# Altium schematic sheet IoTaWat_DIN.SchDoc: IoTaWatt_DIN
size 420 x 297 mm; Author: G.Kasprowicz; CompanyName: WUT ISE; DrawnBy: G.Kasprowicz; Organization: WUT ISE; Address1: PW ISE; Address2: Nowowiejska 15/19 00-665 Warsaw; Address3: gkasprow@gmail.com; Revision: 1.0; SheetNumber: 1; SheetTotal: 1; ModifiedBy: -; CheckedDate: -; Title2: v1.0; DivGrp: WUT ISE; Designer: G.Kasprowicz; ModifiedDate: -; ProjectName: Sensor Box
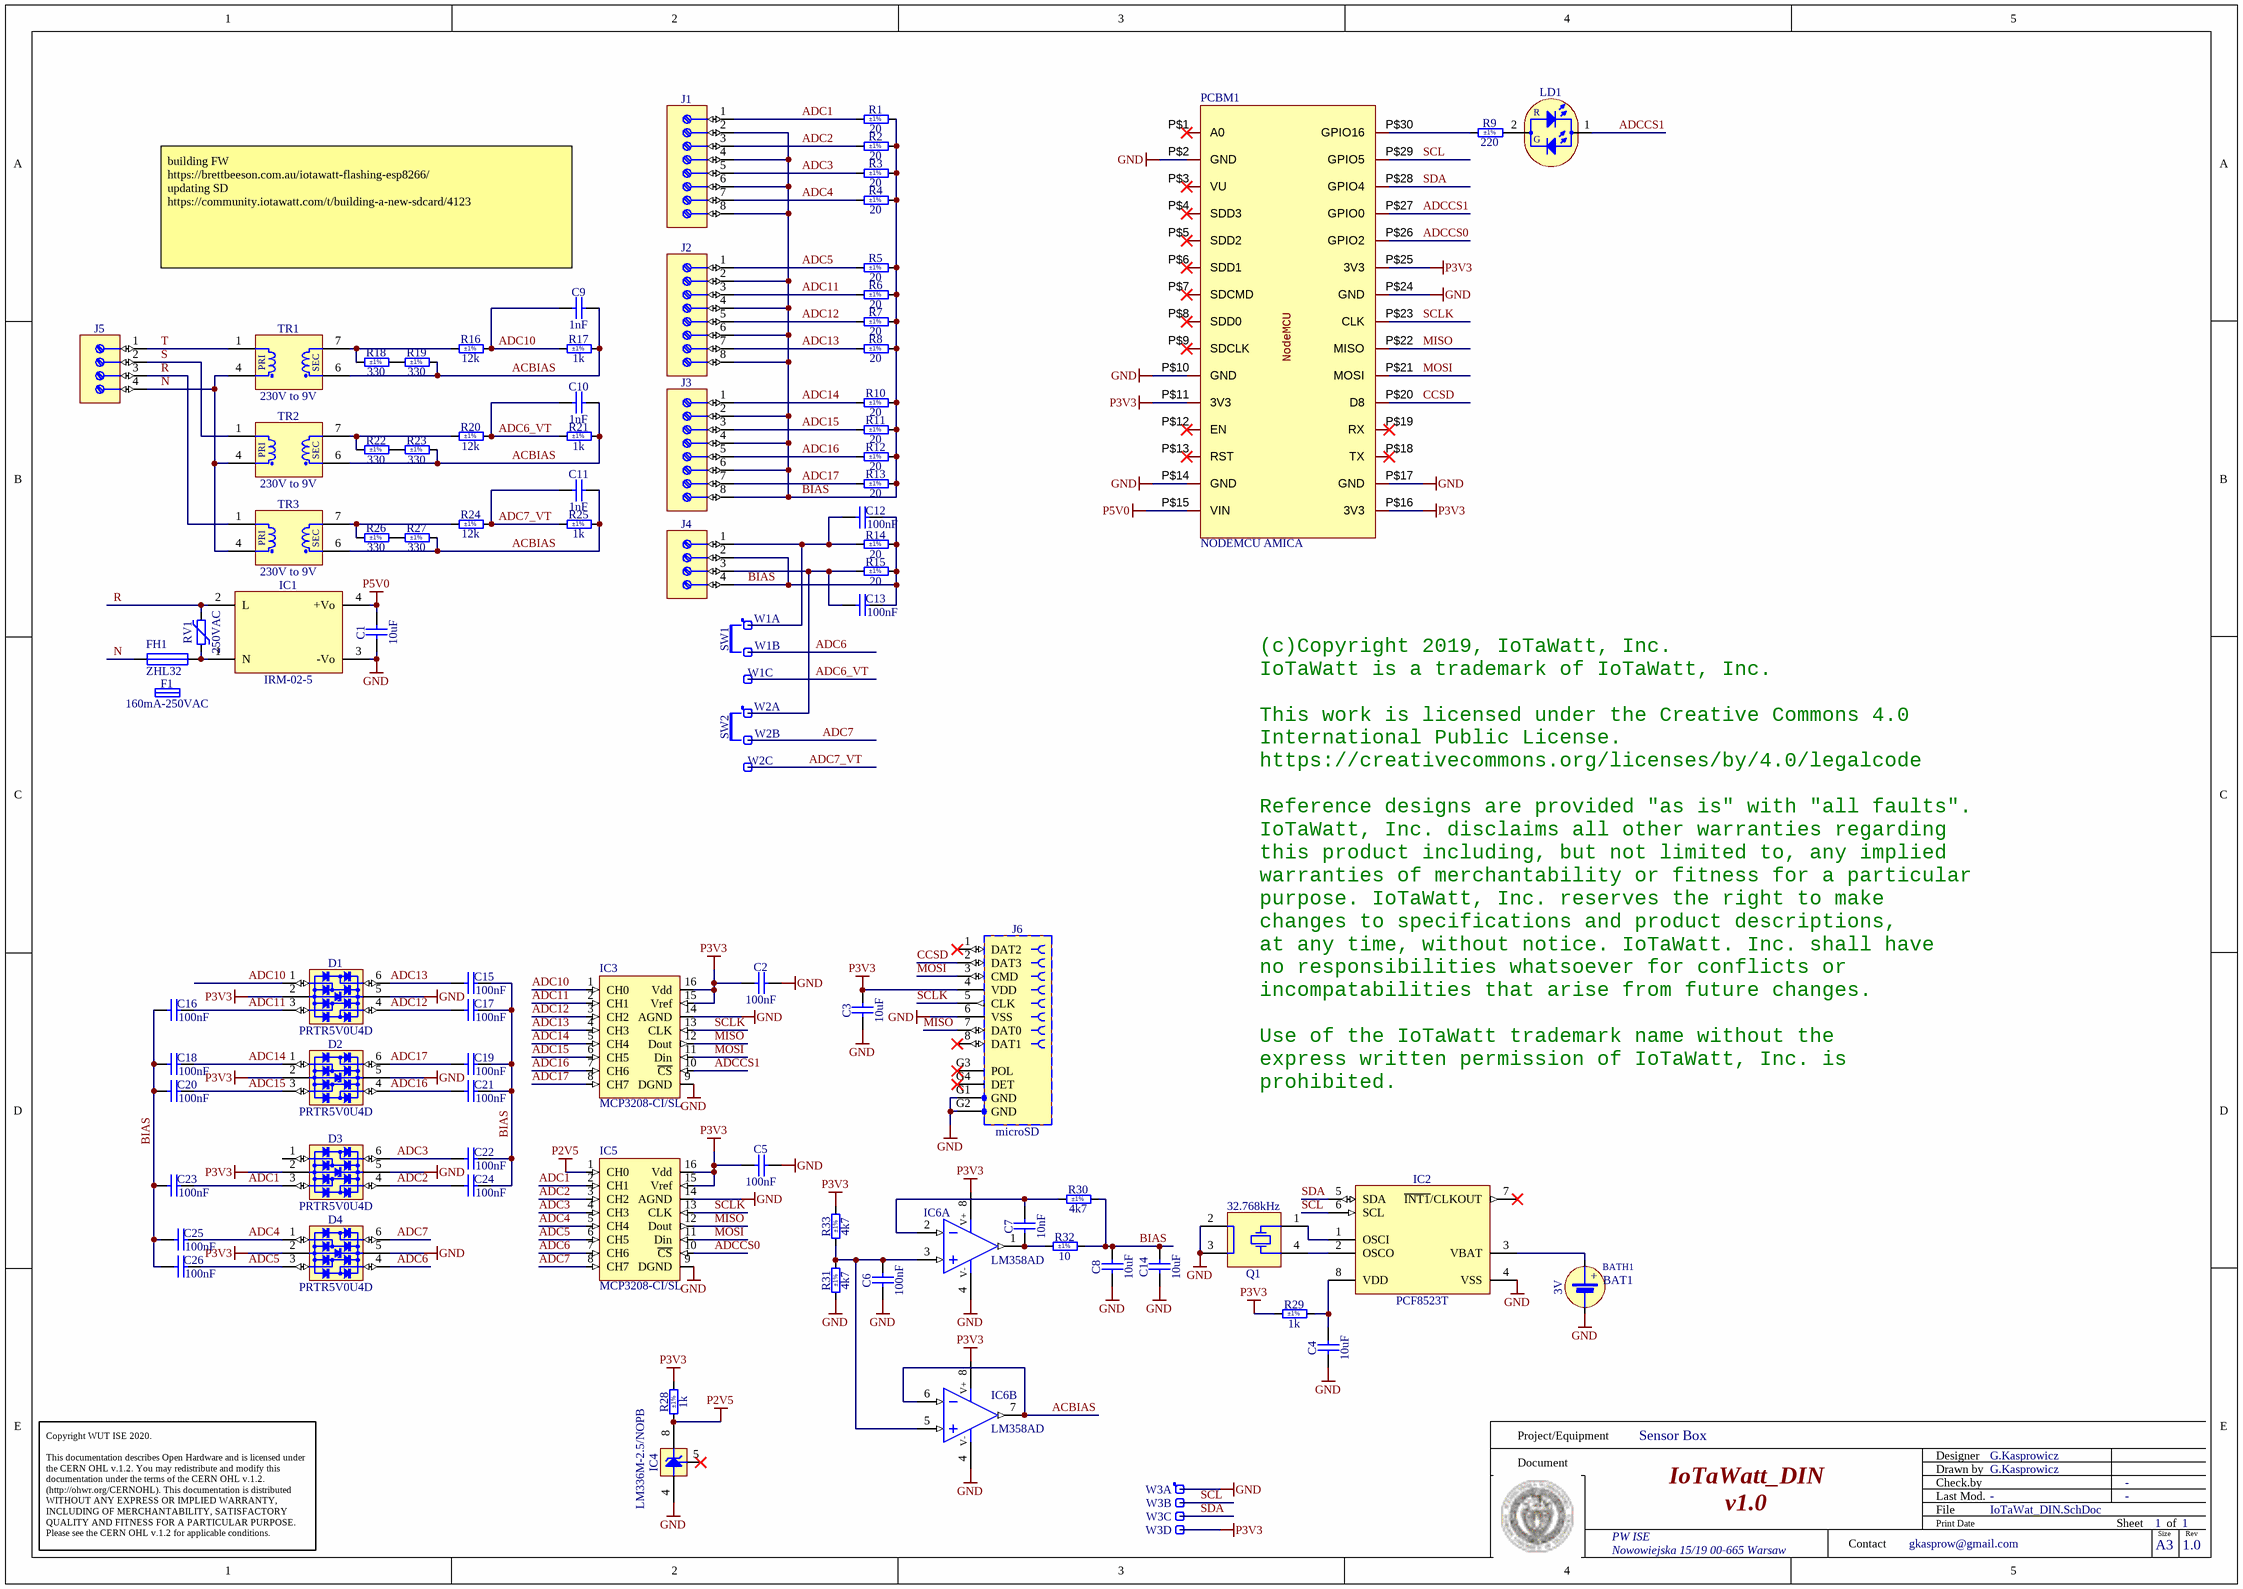
[diagram p0: IoTaWat_DIN.SchDoc]

## Parts
BAT1  3V  [BAT_VARTA_CR1220]
BATH1  (no value)  [BATH_KEYSTONE_3000]
C1  10uF  [CAPC2012X135N]
C2  100nF  [CAPC1608X87N]
C3  10uF  [CAPC2012X135N]
C4  10uF  [CAPC2012X135N]
C5  100nF  [CAPC1608X87N]
C6  100nF  [CAPC1608X87N]
C7  10nF  [CAPC1608X87N]
C8  10uF  [CAPC2012X135N]
C9  1nF  [CAPC1608X90N]
C10  1nF  [CAPC1608X90N]
C11  1nF  [CAPC1608X90N]
C12  100nF  [CAPC1608X87N]
C13  100nF  [CAPC1608X87N]
C14  10uF  [CAPC2012X135N]
C15  100nF  [CAPC1608X87N]
C16  100nF  [CAPC1608X87N]
C17  100nF  [CAPC1608X87N]
C18  100nF  [CAPC1608X87N]
C19  100nF  [CAPC1608X87N]
C20  100nF  [CAPC1608X87N]
C21  100nF  [CAPC1608X87N]
C22  100nF  [CAPC1608X87N]
C23  100nF  [CAPC1608X87N]
C24  100nF  [CAPC1608X87N]
C25  100nF  [CAPC1608X87N]
C26  100nF  [CAPC1608X87N]
D1  PRTR5V0U4D  [SOT95P275X110-6N]
D2  PRTR5V0U4D  [SOT95P275X110-6N]
D3  PRTR5V0U4D  [SOT95P275X110-6N]
D4  PRTR5V0U4D  [SOT95P275X110-6N]
F1  160mA-250VAC  [FUSE_5X20_GLASS_h]
FH1  ZHL32  [fuse_ZHL32]
IC1  IRM-02-5  [PWS_MEANWELL_IRM-02]
IC2  PCF8523T  [SOIC127P600X175-8N]
IC3  MCP3208-CI/SL  [SO-16]
IC4  LM336M-2.5/NOPB  [SOIC127P600X175-8N]
IC5  MCP3208-CI/SL  [SO-16]
IC6  LM358AD  [SOIC127P600X175-8N]  (parts A,B of 2)
J1  (no value)  [PHOENIX_1715789]
J2  (no value)  [PHOENIX_1715789]
J3  (no value)  [PHOENIX_1715789]
J4  (no value)  [PHOENIX_1715747]
J5  (no value)  [PHOENIX_1715747]
J6  microSD  [MOLEX_47309-2651]
LD1  Red/Green  [LED_KINGBRIGHT_L-937EGW]  (value not drawn)
PCBM1  NODEMCU AMICA  [NODEMCU]
Q1  32.768kHz  [XTAL_ABRACON_ABS25]
R1  20  Tolerance: ±1%  [RESC2012X60N]
R2  20  Tolerance: ±1%  [RESC2012X60N]
R3  20  Tolerance: ±1%  [RESC2012X60N]
R4  20  Tolerance: ±1%  [RESC2012X60N]
R5  20  Tolerance: ±1%  [RESC2012X60N]
R6  20  Tolerance: ±1%  [RESC2012X60N]
R7  20  Tolerance: ±1%  [RESC2012X60N]
R8  20  Tolerance: ±1%  [RESC2012X60N]
R9  220  Tolerance: ±1%  [RESC1608X55N]
R10  20  Tolerance: ±1%  [RESC2012X60N]
R11  20  Tolerance: ±1%  [RESC2012X60N]
R12  20  Tolerance: ±1%  [RESC2012X60N]
R13  20  Tolerance: ±1%  [RESC2012X60N]
R14  20  Tolerance: ±1%  [RESC2012X60N]
R15  20  Tolerance: ±1%  [RESC2012X60N]
R16  12k  Tolerance: ±1%  [RESC1608X55N]
R17  1k  Tolerance: ±1%  [RESC1608X55N]
R18  330  Tolerance: ±1%  [RESC3216X65N]
R19  330  Tolerance: ±1%  [RESC3216X65N]
R20  12k  Tolerance: ±1%  [RESC1608X55N]
R21  1k  Tolerance: ±1%  [RESC1608X55N]
R22  330  Tolerance: ±1%  [RESC3216X65N]
R23  330  Tolerance: ±1%  [RESC3216X65N]
R24  12k  Tolerance: ±1%  [RESC1608X55N]
R25  1k  Tolerance: ±1%  [RESC1608X55N]
R26  330  Tolerance: ±1%  [RESC3216X65N]
R27  330  Tolerance: ±1%  [RESC3216X65N]
R28  1k  Tolerance: ±1%  [RESC1608X55N]
R29  1k  Tolerance: ±1%  [RESC1608X55N]
R30  4k7  Tolerance: ±1%  [RESC1608X55N]
R31  4k7  Tolerance: ±1%  [RESC1608X55N]
R32  10  Tolerance: ±1%  [RESC1608X55N]
R33  4k7  Tolerance: ±1%  [RESC1608X55N]
RV1  250VAC  [VAR_EPCOS_B72214S0251K101]
SW1  Jumper Type1  [JUMPER_BLACK_INSULATED_2.54MM]  (value not drawn)
SW2  Jumper Type1  [JUMPER_BLACK_INSULATED_2.54MM]  (value not drawn)
TR1  230V to 9V  [XFMR_BLOCK_TEZ0.5/D]
TR2  230V to 9V  [XFMR_BLOCK_TEZ0.5/D]
TR3  230V to 9V  [XFMR_BLOCK_TEZ0.5/D]
W1  Test Point  [COMATEL_385.0358.1.03.400]  (value not drawn)  (parts A,B,C of 3)
W2  Test Point  [COMATEL_385.0358.1.03.400]  (value not drawn)  (parts A,B,C of 3)
W3  Test Point  [COMATEL_385.0358.1.04.400]  (value not drawn)  (parts A,B,C,D of 4)

## Nets
GND: BATH1.2(MINUS) C1.1 C2.2 C3.1 C4.1 C5.2 C6.1 C8.1 C14.1 D1.5(VBUS) D2.5(VBUS) D3.5(VBUS) D4.5(VBUS) IC1.3(-Vo) IC2.4(VSS) IC3.9(DGND) IC3.14(AGND) IC4.4(A) IC5.9(DGND) IC5.14(AGND) IC6.4(V-) J6.6(VSS) J6.G1(GND) J6.G2(GND) PCBM1.P$2(GND) PCBM1.P$10(GND) PCBM1.P$14(GND) PCBM1.P$17(GND) PCBM1.P$24(GND) Q1.2(GND) Q1.3(GND) R31.1 W3.1
P2V5: IC4.8(C) IC5.1(CH0) R28.1
P3V3: C2.1 C3.2 C5.1 D1.2(GND) D2.2(GND) D3.2(GND) D4.2(GND) IC3.15(Vref) IC3.16(Vdd) IC5.15(Vref) IC5.16(Vdd) IC6.8(V+) J6.4(VDD) PCBM1.P$11(3V3) PCBM1.P$16(3V3) PCBM1.P$25(3V3) R28.2 R29.1 R33.2 W3.4
P5V0: C1.2 IC1.4(+Vo) PCBM1.P$15(VIN)
ACBIAS: C9.2 C10.2 C11.2 IC6.6(IN-) IC6.7(OUT) R17.2 R19.2 R21.2 R23.2 R25.2 R27.2 TR1.6 TR2.6 TR3.6
ADC1: C23.2 D3.3(I/O2) IC5.2(CH1) J1.1 R1.1
ADC2: C24.1 D3.4(I/O3) IC5.3(CH2) J1.3 R2.1
ADC3: C22.1 D3.6(I/O4) IC5.4(CH3) J1.5 R3.1
ADC4: C25.2 D4.1(I/O1) IC5.5(CH4) J1.7 R4.1
ADC5: C26.2 D4.3(I/O2) IC5.6(CH5) J2.1 R5.1
ADC6: D4.4(I/O3) IC5.7(CH6) W1.2
ADC6_VT: C10.1 R20.2 R21.1 W1.3
ADC7: D4.6(I/O4) IC5.8(CH7) W2.2
ADC7_VT: C11.1 R24.2 R25.1 W2.3
ADC10: C9.1 D1.1(I/O1) IC3.1(CH0) R16.2 R17.1
ADC11: C16.2 D1.3(I/O2) IC3.2(CH1) J2.3 R6.1
ADC12: C17.1 D1.4(I/O3) IC3.3(CH2) J2.5 R7.1
ADC13: C15.1 D1.6(I/O4) IC3.4(CH3) J2.7 R8.1
ADC14: C18.2 D2.1(I/O1) IC3.5(CH4) J3.1 R10.1
ADC15: C20.2 D2.3(I/O2) IC3.6(CH5) J3.3 R11.1
ADC16: C21.1 D2.4(I/O3) IC3.7(CH6) J3.5 R12.1
ADC17: C19.1 D2.6(I/O4) IC3.8(CH7) J3.7 R13.1
ADCCS0: IC5.10(~{CS}) PCBM1.P$26(GPIO2)
ADCCS1: IC3.10(~{CS}) LD1.1(CR) PCBM1.P$27(GPIO0)
BIAS: C8.2 C12.2 C13.2 C14.2 C15.2 C16.1 C17.2 C18.1 C19.2 C20.1 C21.2 C22.2 C23.1 C24.2 C25.1 C26.1 J1.2 J1.4 J1.6 J1.8 J2.2 J2.4 J2.6 J2.8 J3.2 J3.4 J3.6 J3.8 J4.2 J4.4 R1.2 R2.2 R3.2 R4.2 R5.2 R6.2 R7.2 R8.2 R10.2 R11.2 R12.2 R13.2 R14.2 R15.2 R30.2 R32.2
CCSD: J6.2(DAT3) PCBM1.P$20(D8)
MISO: IC3.12(Dout) IC5.12(Dout) J6.7(DAT0) PCBM1.P$22(MISO)
MOSI: IC3.11(Din) IC5.11(Din) J6.3(CMD) PCBM1.P$21(MOSI)
N: FH1.1 J5.4 TR1.4 TR2.4 TR3.4
R: IC1.2(L) J5.3 RV1.2 TR3.1
S: J5.2 TR2.1
SCL: IC2.6(SCL) PCBM1.P$29(GPIO5) W3.2
SCLK: IC3.13(CLK) IC5.13(CLK) J6.5(CLK) PCBM1.P$23(CLK)
SDA: IC2.5(SDA) PCBM1.P$28(GPIO4) W3.3
T: J5.1 TR1.1
NetBATH1_1: BATH1.1(PLUS) IC2.3(VBAT)
NetC4_2: C4.2 IC2.8(VDD) R29.2
NetC6_2: C6.2 IC6.3(IN+) IC6.5(IN+) R31.2 R33.1
NetC7_1: C7.1 IC6.1(OUT) R32.1
NetC7_2: C7.2 IC6.2(IN-) R30.1
NetC12_1: C12.1 J4.1 R14.1 W1.1
NetC13_1: C13.1 J4.3 R15.1 W2.1
NetFH1_2: FH1.2 IC1.1(N) RV1.1
NetIC2_1: IC2.1(OSCI) Q1.1(X)
NetIC2_2: IC2.2(OSCO) Q1.4(X)
NetLD1_2: LD1.2(AR) R9.2
NetPCBM1_P$30: PCBM1.P$30(GPIO16) R9.1
NetR16_1: R16.1 R18.1 TR1.7
NetR18_2: R18.2 R19.1
NetR20_1: R20.1 R22.1 TR2.7
NetR22_2: R22.2 R23.1
NetR24_1: R24.1 R26.1 TR3.7
NetR26_2: R26.2 R27.1

Not connected (* = marked no-connect by the designer): D3 1(I/O1); IC2 7(~{INT1}/CLKOUT)*; IC4 5(Adj)*; J6 1(DAT2)* 8(DAT1)* G3(POL)* G4(DET)*; PCBM1 P$1(A0)* P$3(VU)* P$4(SDD3)* P$5(SDD2)* P$6(SDD1)* P$7(SDCMD)* P$8(SDD0)* P$9(SDCLK)* P$12(EN)* P$13(RST)* P$18(TX)* P$19(RX)*; SW1 1; SW2 1

## Notes on the sheet
- (near C9) building FW
  https://brettbeeson.com.au/iotawatt-flashing-esp8266/
  updating SD
  https://community.iotawatt.com/t/building-a-new-sdcard/4123
- (c)Copyright 2019, IoTaWatt, Inc.
  IoTaWatt is a trademark of IoTaWatt, Inc.
  This work is licensed under the Creative Commons 4.0
  International Public License.
  https://creativecommons.org/licenses/by/4.0/legalcode
  Reference designs are provided "as is" with "all faults".
  IoTaWatt, Inc. disclaims all other warranties regarding
  this product including, but not limited to, any implied
  warranties of merchantability or fitness for a particular
  purpose. IoTaWatt, Inc. reserves the right to make
  changes to specifications and product descriptions,
  at any time, without notice. IoTaWatt. Inc. shall have
  no responsibilities whatsoever for conflicts or
  incompatabilities that arise from future changes.
  Use of the IoTaWatt trademark name without the
  express written permission of IoTaWatt, Inc. is
  prohibited.
- Project/Equipment
- Document
- Designer
- Drawn by
- Check.by
- Copyright WUT ISE 2020.
  This documentation describes Open Hardware and is licensed under the CERN OHL v.1.2. You may redistribute and modify this documentation under the terms of the CERN OHL v.1.2. (http://ohwr.org/CERNOHL). This documentation is distributed WITHOUT ANY EXPRESS OR IMPLIED WARRANTY, INCLUDING OF MERCHANTABILITY, SATISFACTORY QUALITY AND FITNESS FOR A PARTICULAR PURPOSE. Please see the CERN OHL v.1.2 for applicable conditions.
- Contact
- File
- Last Mod.
- Print Date
- Sheet
- Size
- A3
- of
- Rev
- (in symbol BAT_VARTA_CR1220) +
- (in symbol BATH_KEYSTONE_3000) +
- (in symbol LED_KINGBRIGHT_L-937EGW) R; G
- (in symbol Tr_TEZ0.5/D230/9V) PRI; SEC

## Library data of the parts
BAT1 = BAT_VARTA_CR1220: Battery for use only with Socket Holder; Part Description: CR1210, 12.5mm Diameter x 2mm  Height Lithium Coin Cells; Manufacturer: VARTA; Manufacturer Part Number: 6220; PressFit: No; Power: 35mAh; Part Number: BAT_VARTA_CR1220; Component Kind: Accessories; Component Type: Standard; Pin Count: 0; PackageDescription: CR1210, 12.5mm Diameter x 2mm  Height Lithium Coin Cells; Family: Battery; Mounted: Yes; Socket: Yes; SMD: No; Sense: No; Value: 3V; ComponentHeight: 2mm; HelpURL: \\cern.ch\dfs\Applications\Altium\Datasheets\BAT_VARTA_CR1220.pdf; Author: CERN DEM JLC; CreateDate: 17.04.2012; LatestRevisionDate: 17.04.2012
BATH1 = BATH_KEYSTONE_3000: Battery Holder whit 2 Pin; Part Description: SMD Battery Holder for CR1216, BR1220, CL1225, SR1120, D381, 391, 191 Coin Cells; Manufacturer Part Number: 3000; PressFit: No; Part Number: BATH_KEYSTONE_3000; Component Kind: Standard; Component Type: Standard; Pin Count: 3; PackageDescription: SMD Battery Holder for CR1216, BR1220, CL1225, SR1120, D381, 391, 191 Coin Cells; Family: Battery; Mounted: Yes; Socket: No; SMD: Yes; Sense: No; Manufacturer: KEYSTONE; ComponentHeight: 3.17mm; HelpURL: \\cern.ch\dfs\Applications\Altium\Datasheets\BATH_KEYSTONE_3000.pdf; Author: CERN DEM JLC; CreateDate: 17.04.2012; LatestRevisionDate: 07.06.2017
C1 C3 C4 C8 C14 = CC0805_10UF_10V_10%_X7R: Non-polarised capacitor; Part Description: SMD Multilayer Chip Ceramic Capacitor; Manufacturer: GENERIC; Manufacturer1 Part Number: GRM21BR71A106KE51L; Voltage: 10V; TC: X7R; Tolerance: ±10%; Part Number: CC0805_10UF_10V_10%_X7R; Component Kind: Standard; Component Type: Standard; Pin Count: 2; Value: 10uF; Status: Preferred; Manufacturer Part Number: CC0805_10UF_10V_10%_X7R; Case: 0805; Mounted: Yes; Socket: No; SMD: Yes; Sense: No; Manufacturer1 Example: MURATA; Manufacturer1 ComponentHeight: 1.35mm; HelpURL: \\cern.ch\dfs\Applications\Altium\Datasheets\CC0805_X7R_MURATA.pdf; Author: CERN DEM JLC; CreateDate: 30.04.2012; LatestRevisionDate: 30.04.2012
C2 C5 C6 C12 C13 C15-C26 = CC0603_100NF_50V_10%_X5R: Non-polarised capacitor; Part Description: SMD Multilayer Chip Ceramic Capacitor; Manufacturer: GENERIC; Manufacturer1 Part Number: C1608X5R1H104K080; Voltage: 50V; TC: X5R; Tolerance: ±10%; Part Number: CC0603_100NF_50V_10%_X5R; Component Kind: Standard; Component Type: Standard; Pin Count: 2; Value: 100nF; Status: None; Manufacturer Part Number: CC0603_100NF_50V_10%_X5R; Case: 0603; Mounted: Yes; Socket: No; SMD: Yes; Sense: No; Manufacturer1 Example: TDK; Manufacturer1 ComponentHeight: 0.9mm; HelpURL: \\cern.ch\dfs\Applications\Altium\Datasheets\CC0603_X5R_TDK_C.pdf; Author: CERN DEM MR; CreateDate: 08.01.2016; LatestRevisionDate: 08.01.2016
C7 = CC0603_10NF_50V_5%_C0G: Non-polarised capacitor; Part Description: SMD Multilayer Chip Ceramic Capacitor; Manufacturer: GENERIC; Manufacturer1 Part Number: C1608C0G1H103J080; Voltage: 50V; TC: C0G/NP0; Tolerance: ±5%; Part Number: CC0603_10NF_50V_5%_C0G; Component Kind: Standard; Component Type: Standard; Pin Count: 2; Value: 10nF; Status: Preferred; Manufacturer Part Number: CC0603_10NF_50V_5%_C0G; Case: 0603; Mounted: Yes; Socket: No; SMD: Yes; Sense: No; Manufacturer1 Example: TDK; Manufacturer1 ComponentHeight: 0.9mm; HelpURL: \\cern.ch\dfs\Applications\Altium\Datasheets\CC0603_C0G_TDK_C.pdf; Author: CERN DEM JLC; CreateDate: 10.12.2014; LatestRevisionDate: 10.12.2014
C9-C11 = CC0603_1NF_50V_1%_NP0: Non-polarised capacitor; Part Description: SMD Multilayer Chip Ceramic Capacitor; Manufacturer: GENERIC; Manufacturer1 Part Number: 06035A102FAT2A; Voltage: 50V; TC: C0G/NP0; Tolerance: ±1%; Part Number: CC0603_1NF_50V_1%_NP0; Component Kind: Standard; Component Type: Standard; Pin Count: 2; Value: 1nF; Status: None; Manufacturer Part Number: CC0603_1NF_50V_1%_NP0; Case: 0603; Mounted: Yes; Socket: No; SMD: Yes; Sense: No; Manufacturer1 Example: AVX; Manufacturer1 ComponentHeight: 0.9mm; HelpURL: \\cern.ch\dfs\Applications\Altium\Datasheets\CC0603_C0G_AVX.pdf; Author: CERN DEM JLC; CreateDate: 15.06.2017; LatestRevisionDate: 15.06.2017
D1-D4 = PRTR5V0U4D: Ultra Low Capacitance Quadruple Rail-to-Rail ESD Protection; Part Description: Ultra Low Capacitance Quadruple Rail-to-Rail ESD (±8kV) Protection; Manufacturer: NEXPERIA; PressFit: No; Bonding: No; Part Number: PRTR5V0U4D; Component Kind: Standard; Component Type: Standard; Device: PRTR5V0U4D; PackageDescription: SOT, 0.95mm Pitch; 6 Pin, 1.50mm W X 2.90mm L X 1.10mm H body, IPC Medium Density; Manufacturer Part Number: PRTR5V0U4D; Pin Count: 6; Case: SOT457-6; Mounted: Yes; Socket: No; SMD: Yes; Sense: No; ComponentHeight: 1.1mm; HelpURL: \\cern.ch\dfs\Applications\Altium\Datasheets\PRTR5V0U4D.pdf; Author: CERN DEM BC; CreateDate: 06.01.2021; LatestRevisionDate: 06.01.2021
F1 = FUSE_SCHURTER_0034.1508_h: Fuse; Part Description: Cylindrical 5x20 mm, Quick-Acting F Miniature Fuse, FSF Series; PressFit: No; Part Number: FUSE_SCHURTER_0034.1508_h; Component Kind: Accessories; Component Type: Standard; Pin Count: 0; PackageDescription: 5x20mm Cylindrical Fuse, SCHURTER FSF5X20 Series; Family: Fuse; Mounted: Yes; Socket: Yes; SMD: No; Sense: No; Value: 160mA-250VAC; Manufacturer: SCHURTER; Manufacturer Part Number: 0034.1508; ComponentHeight: 5.2mm; HelpURL: \\cern.ch\dfs\Applications\Altium\Datasheets\FUSE_SCHURTER_FSF5X20.pdf; Author: CERN DEM JLC; CreateDate: 08.11.2012; LatestRevisionDate: 08.11.2012
FH1 = FUSE
IC1 = AC_DC_IRM-02-5: Power Supply; Part Description: 85-305VAC to 5VDC (400mA) 2W Power Supply; Manufacturer: MEAN WELL; PressFit: No; Bonding: No; Part Number: IRM-02-5; Component Kind: Standard; Component Type: Standard; Device: IRM-02-5; PackageDescription: IRM-02 Series, Body 33.7x22.2mm, Power Supply; Status: None; Manufacturer Part Number: IRM-02-5; Pin Count: 4; Mounted: Yes; Socket: No; SMD: No; Sense: No; ComponentHeight: 15mm; HelpURL: \\cern.ch\dfs\Applications\Altium\Datasheets\IRM-02-24.pdf; Author: GK; CreateDate: 14.02.2018; LatestRevisionDate: 14.02.2018
IC2 = PCF8523T: Real-Time Clock (RTC) and calendar; Manufacturer: NXP SEMICONDUCTORS; PressFit: No; Bonding: No; Part Number: PCF8523T; Component Kind: Standard; Component Type: Standard; Device: PCF8523T; PackageDescription: SOIC 8, Pitch 1.27mm, Body 4x5mm, IPC Medium Density; Part Description: Real-Time Clock (RTC) and calendar; Manufacturer Part Number: PCF8523T; Pin Count: 8; Case: SOIC8; Mounted: Yes; Socket: No; SMD: Yes; Sense: No; ComponentHeight: 1.75mm; Author: CERN DEM HF; HelpURL: \\cern.ch\dfs\Applications\Altium\Datasheets\PCF8523.pdf; CreateDate: 07.02.2023; LatestRevisionDate: 07.02.2023
IC3 IC5 = ADC_MCP3208: 8-Channel 12-Bit A/D with SPI
IC4 = LM336M-2.5/NOPB: Reference Diode; Part Description: 2.5V Voltage Reference Diode; Manufacturer: TEXAS INSTRUMENTS; PressFit: No; Bonding: No; Part Number: LM336M-2.5/NOPB; Component Kind: Standard; Component Type: Standard; Device: LM336M-2.5/NOPB; PackageDescription: SOIC 8, Pitch 1.27mm, Body 4x5mm, IPC Medium Density; Manufacturer Part Number: LM336M-2.5; Pin Count: 3; Case: SOIC8; Mounted: Yes; Socket: No; SMD: Yes; Sense: No; ComponentHeight: 1.75mm; HelpURL: \\cern.ch\dfs\Applications\Altium\Datasheets\LM336M-2.5-NOPB.pdf; Author: CERN DEM JLC; CreateDate: 12.04.2010; LatestRevisionDate: 01.06.2022
IC6 = LM358AD: Dual Operational Amplifier; Part Description: Dual Operational Amplifier, Vos=3mV, Iq/CH=350uA, 0°C to 70°C; Manufacturer: TEXAS INSTRUMENTS; PressFit: No; Bonding: No; Part Number: LM358AD; Component Kind: Standard; Component Type: Standard; Device: LM358AD; PackageDescription: SOIC 8, Pitch 1.27mm - Body 4x5mm, IPC Medium Density; Manufacturer Part Number: LM358AD; Pin Count: 8; Case: SOIC8; Mounted: Yes; Socket: No; SMD: Yes; Sense: No; ComponentHeight: 1.75mm; Author: CERN DEM JLC; HelpURL: \\cern.ch\dfs\Applications\Altium\Datasheets\LM358A.pdf; CreateDate: 02.12.2008; LatestRevisionDate: 06.09.2021
J1-J3 = PHOENIX_1715789: Terminal Block, 8 Positions, Screw Connection; Part Description: 17.5A, 400V, Terminal Block, Pitch 5.08mm, 8 Positions, Screw Connection; Manufacturer: PHOENIX CONTACT; Manufacturer Part Number: 1715789 (MKDS 1,5/8-5,08); PressFit: No; Part Number: PHOENIX_1715789; Component Kind: Standard; Component Type: Standard; Pin Count: 8; Mounted: Yes; Socket: No; SMD: No; Sense: No; Status: None; ComponentHeight: 13.8mm; HelpURL: \\cern.ch\dfs\Applications\Altium\Datasheets\PHOENIX_1715789.pdf; Author: CERN DEM JMW; CreateDate: 25.02.2013; LatestRevisionDate: 25.02.2013
J4 J5 = PHOENIX_1715747: Terminal Block, 4 Positions, Screw Connection; Part Description: 17.5A, 400V, Terminal Block, Pitch 5.08mm, 4 Positions, Screw Connection; Manufacturer: PHOENIX CONTACT; Manufacturer Part Number: 1715747 (MKDS 1,5/4-5,08); PressFit: No; Part Number: PHOENIX_1715747; Component Kind: Standard; Component Type: Standard; Pin Count: 4; Mounted: Yes; Socket: No; SMD: No; Sense: No; Status: None; ComponentHeight: 13.8mm; HelpURL: \\cern.ch\dfs\Applications\Altium\Datasheets\PHOENIX_1715747.pdf; Author: CERN DEM JMW; CreateDate: 25.02.2013; LatestRevisionDate: 25.02.2013
J6 = MOLEX_47309-2651: MicroSD Card Header with Detect Switch; Part Description: 1.10mm Pitch microSD Card Header with Detect Switch; Manufacturer: MOLEX; PressFit: No; Part Number: MOLEX_47309-2651; Component Kind: Standard; Component Type: Standard; Pin Count: 12; Family: microSD; Mounted: Yes; Socket: No; SMD: Yes; Sense: No; Status: None; Manufacturer Part Number: 47309-2651; ComponentHeight: 2.65mm; HelpURL: \\cern.ch\dfs\Applications\Altium\Datasheets\MOLEX_47309-2651.pdf; Author: CERN DEM JMW; CreateDate: 29.06.2017; LatestRevisionDate: 29.06.2017
LD1 = LED_KINGBRIGHT_L-937EGW: Red/ Green Bi color LED Pin 1 = Cathode Red Anode Green; Part Description: 3mm Diameter, Bi-Color Red/Green LED Lamp; PressFit: No; Bonding: No; Part Number: LED_KINGBRIGHT_L-937EGW; Component Kind: Standard; Component Type: Standard; Color: Red/Green; PackageDescription: Bi-Color (Red/ Green), 3mm Diameter LED, Leads Spacing 2.54mm; Manufacturer: KINGBRIGHT; Manufacturer Part Number: L-937EGW; Pin Count: 2; Mounted: Yes; Socket: No; SMD: No; Sense: No; ComponentHeight: 5.9mm; HelpURL: \\cern.ch\dfs\Applications\Altium\Datasheets\LED_KINGBRIGHT_L-937EGW.pdf; Author: CERN DEM JLC; CreateDate: 25.09.2017; LatestRevisionDate: 25.09.2017
PCBM1 = MOD_NODEMCU: NodeMCU 1.0 ESP8266; GateName_1: G$1; SymbolName_1: NODEMCU; LibraryName: IotaWatt_parts; DeviceSetName: NODEMCU; NodeMCU: NodeMCU
Q1 = XTAL_32.768KHZ_ABRACON_ABS25-32.768KHZ-T: Crystal 4 pins 1=XTAL Control 2 And 3=NC 4=XTAL; Part Description: Tolerance: ±20ppm, -40°C to +85°C, 12.5pF, SMD Crystal, ABS25 Series; PressFit: No; Bonding: No; Part Number: XTAL_32.768KHZ_ABRACON_ABS25-32.768KHZ-T; Component Kind: Standard; Component Type: Standard; PackageDescription: SMD Crystal, 4 Pins, 8.00mm L X 3.80mm W X 2.70mm H, ABS25 Serie; Value: 32.768kHz; Manufacturer: ABRACON; Manufacturer Part Number: ABS25-32.768KHZ-T; Pin Count: 4; Mounted: Yes; Socket: No; SMD: Yes; Sense: No; ComponentHeight: 2.7mm; HelpURL: \\cern.ch\dfs\Applications\Altium\Datasheets\XTAL_ABRACON_ABS25.pdf; Author: CERN DEM JMW; CreateDate: 15.07.2015; LatestRevisionDate: 15.07.2015
R1-R8 R10-R15 = R0805_20R_1%_0.125W_100PPM: Resistor - 1%; Part Description: General Purpose Thick Film Chip Resistor; Manufacturer: GENERIC; Manufacturer1 Part Number: NRC10F20R0TRF; Power: 0.125W; TC: ±100ppm/°C; PressFit: No; Part Number: R0805_20R_1%_0.125W_100PPM; Component Kind: Standard; Component Type: Standard; Pin Count: 2; Value: 20; Status: Preferred; Manufacturer Part Number: R0805_20R_1%_0.125W_100PPM; Case: 0805; Mounted: Yes; Sense: No; Socket: No; SMD: Yes; Manufacturer1 Example: NIC COMPONENT; Manufacturer1 ComponentHeight: 0.6mm; HelpURL: \\cern.ch\dfs\Applications\Altium\Datasheets\R0805_NIC_NRC.pdf; Author: CERN DEM JLC; CreateDate: 03.12.2007; LatestRevisionDate: 13.03.2008
R9 = R0603_220R_1%_0.1W_100PPM: Resistor - 1%; Part Description: General Purpose Thick Film Chip Resistor; Manufacturer: GENERIC; Manufacturer1 Part Number: NRC06F2200TRF; Power: 0.1W; TC: ±100ppm/°C; PressFit: No; Part Number: R0603_220R_1%_0.1W_100PPM; Component Kind: Standard; Component Type: Standard; Pin Count: 2; Value: 220; Status: Preferred; Manufacturer Part Number: R0603_220R_1%_0.1W_100PPM; Case: 0603; Mounted: Yes; Sense: No; Socket: No; SMD: Yes; Manufacturer1 Example: NIC COMPONENT; Manufacturer1 ComponentHeight: 0.55mm; HelpURL: \\cern.ch\dfs\Applications\Altium\Datasheets\R0603_NIC_NRC.pdf; Author: CERN DEM JLC; CreateDate: 03.12.2007; LatestRevisionDate: 13.03.2008
R16 R20 R24 = R0603_12K_1%_0.1W_100PPM: Resistor - 1%; Part Description: General Purpose Thick Film Chip Resistor; Manufacturer: GENERIC; Manufacturer1 Part Number: NRC06F1202TRF; Power: 0.1W; TC: ±100ppm/°C; PressFit: No; Part Number: R0603_12K_1%_0.1W_100PPM; Component Kind: Standard; Component Type: Standard; Pin Count: 2; Value: 12k; Status: Preferred; Manufacturer Part Number: R0603_12K_1%_0.1W_100PPM; Case: 0603; Mounted: Yes; Sense: No; Socket: No; SMD: Yes; Manufacturer1 Example: NIC COMPONENT; Manufacturer1 ComponentHeight: 0.55mm; HelpURL: \\cern.ch\dfs\Applications\Altium\Datasheets\R0603_NIC_NRC.pdf; Author: CERN DEM JLC; CreateDate: 03.12.2007; LatestRevisionDate: 13.03.2008
R17 R21 R25 R28 R29 = R0603_1K_1%_0.1W_100PPM: Resistor - 1%; Part Description: General Purpose Thick Film Chip Resistor; Manufacturer: GENERIC; Manufacturer1 Part Number: NRC06F1001TRF; Power: 0.1W; TC: ±100ppm/°C; PressFit: No; Part Number: R0603_1K_1%_0.1W_100PPM; Component Kind: Standard; Component Type: Standard; Pin Count: 2; Value: 1k; Status: Preferred; Manufacturer Part Number: R0603_1K_1%_0.1W_100PPM; Case: 0603; Mounted: Yes; Sense: No; Socket: No; SMD: Yes; Manufacturer1 Example: NIC COMPONENT; Manufacturer1 ComponentHeight: 0.55mm; HelpURL: \\cern.ch\dfs\Applications\Altium\Datasheets\R0603_NIC_NRC.pdf; Author: CERN DEM JLC; CreateDate: 03.12.2007; LatestRevisionDate: 13.03.2008
R18 R19 R22 R23 R26 R27 = R1206_330R_1%_0.25W_100PPM: Resistor - 1%; Part Description: General Purpose Thick Film Chip Resistor; Manufacturer: GENERIC; Manufacturer1 Part Number: NRC12F3300TRF; Power: 0.25W; TC: ±100ppm/°C; PressFit: No; Part Number: R1206_330R_1%_0.25W_100PPM; Component Kind: Standard; Component Type: Standard; Pin Count: 2; Value: 330; Status: Preferred; Manufacturer Part Number: R1206_330R_1%_0.25W_100PPM; Case: 1206; Mounted: Yes; Sense: No; Socket: No; SMD: Yes; Manufacturer1 Example: NIC COMPONENT; Manufacturer1 ComponentHeight: 0.65mm; HelpURL: \\cern.ch\dfs\Applications\Altium\Datasheets\R1206_NIC_NRC.pdf; Author: CERN DEM JLC; CreateDate: 03.12.2007; LatestRevisionDate: 13.03.2008
R30 R31 R33 = R0603_4K7_1%_0.1W_100PPM: Resistor - 1%; Part Description: General Purpose Thick Film Chip Resistor; Manufacturer: GENERIC; Manufacturer1 Part Number: NRC06F4701TRF; Power: 0.1W; TC: ±100ppm/°C; PressFit: No; Part Number: R0603_4K7_1%_0.1W_100PPM; Component Kind: Standard; Component Type: Standard; Pin Count: 2; Value: 4k7; Status: Preferred; Manufacturer Part Number: R0603_4K7_1%_0.1W_100PPM; Case: 0603; Mounted: Yes; Sense: No; Socket: No; SMD: Yes; Manufacturer1 Example: NIC COMPONENT; Manufacturer1 ComponentHeight: 0.55mm; HelpURL: \\cern.ch\dfs\Applications\Altium\Datasheets\R0603_NIC_NRC.pdf; Author: CERN DEM JLC; CreateDate: 03.12.2007; LatestRevisionDate: 13.03.2008
R32 = R0603_10R_1%_0.1W_200PPM: Resistor - 1%; Part Description: General Purpose Thick Film Chip Resistor; Manufacturer: GENERIC; Manufacturer1 Part Number: NRC06F10R0TRF; Power: 0.1W; TC: ±200ppm/°C; PressFit: No; Part Number: R0603_10R_1%_0.1W_200PPM; Component Kind: Standard; Component Type: Standard; Pin Count: 2; Value: 10; Status: Preferred; Manufacturer Part Number: R0603_10R_1%_0.1W_200PPM; Case: 0603; Mounted: Yes; Sense: No; Socket: No; SMD: Yes; Manufacturer1 Example: NIC COMPONENT; Manufacturer1 ComponentHeight: 0.55mm; HelpURL: \\cern.ch\dfs\Applications\Altium\Datasheets\R0603_NIC_NRC.pdf; Author: CERN DEM JLC; CreateDate: 03.12.2007; LatestRevisionDate: 24.06.2009
RV1 = VAR_EPCOS_B72214S0251K101: Varistor; Part Description: SIOV Metal Oxide Varistor; Manufacturer: EPCOS / TDK; Manufacturer Part Number: B72214S0251K101 or S14K250; Power: 0.6W; Tolerance: ±10%; Part Number: VAR_EPCOS_B72214S0251K101; Component Kind: Standard; Component Type: Standard; Pin Count: 2; Status: None; Voltage: 250VAC; Mounted: Yes; Socket: No; SMD: No; Sense: No; ComponentHeight: 18.5mm; HelpURL: \\cern.ch\dfs\Applications\Altium\Datasheets\VAR_EPCOS_B72214S0251K101.pdf; Author: CERN DEM JLC; CreateDate: 15.09.2011; LatestRevisionDate: 16.09.2011
SW1 SW2 = COMATEL_313.1730.0.00.40.0: Jumper 1 Pin; Part Description: Closed Insulated Black Jumper Pitch 2.54mm; Manufacturer: KONTEK COMATEL; PressFit: No; SCEM: 09.55.10.960.9; Part Number: COMATEL_313.1730.0.00.40.0; Component Kind: Accessories; Component Type: Standard; Pin Count: 1; Family: Jumper; Mounted: Yes; Socket: No; SMD: No; Sense: No; Status: Obsolete; Manufacturer Part Number: 313.1730.0.00.40.0; ComponentHeight: 6.5mm; HelpURL: \\cern.ch\dfs\Applications\Altium\Datasheets\COMATEL_313.1730.0.00.40.0.pdf; Author: CERN DEM JLC; CreateDate: 09.04.2008; LatestRevisionDate: 27.08.2013
TR1-TR3 = Tr_TEZ0.5/D230/9V: Transformer 1xPrim 1xSec Type1; Part Number: XFMR_BLOCK_TEZ0.5/D230/9V; Part Description: 0.5VA Short Circuit Proof PCB Transformer Type VB; Manufacturer: Breve; Manufacturer Part Number: TEZ0.5/D230/9V or VB 0.5/1/9; Component Kind: Standard; Component Type: Standard; Pin Count: 4; Value: 230V to 9V; Status: None; Mounted: Yes; Socket: No; Sense: No; SMD: No; ComponentHeight: 19mm; HelpURL: \\cern.ch\dfs\Applications\Altium\Datasheets\XFMR_BLOCK_VB 0.5-1-9.pdf; Author: GK; CreateDate: 04.09.2012; LatestRevisionDate: 04.09.2012
W1 W2 = COMATEL_385.0358.1.03.400: 3 Mini Wire-Wrap Contact Strip Header; Part Description: 3 Contacts Straight Strip Header Pitch 2.54mm L=6.3mm ''Mini-Wire-Wrap''; Manufacturer: KONTEK COMATEL; PressFit: No; Part Number: COMATEL_385.0358.1.03.400; Component Kind: Standard; Component Type: Standard; Pin Count: 3; Family: Test Point; Mounted: Yes; Socket: No; SMD: No; Sense: No; Status: Not recommended; Manufacturer Part Number: 385.0358.1.03.400; ComponentHeight: 8mm; HelpURL: \\cern.ch\dfs\Applications\Altium\Datasheets\COMATEL_385.0358.1.03.400.pdf; Author: CERN DEM JLC; CreateDate: 30.06.2010; LatestRevisionDate: 10.10.2012
W3 = COMATEL_385.0358.1.04.400: 4 Mini Wire-Wrap Contact Strip Header; Part Description: 4 Contacts Straight Strip Header Pitch 2.54mm L=6.3mm ''Mini-Wire-Wrap''; Manufacturer: KONTEK COMATEL; PressFit: No; Part Number: COMATEL_385.0358.1.04.400; Component Kind: Standard; Component Type: Standard; Pin Count: 4; Family: Test Point; Mounted: Yes; Socket: No; SMD: No; Sense: No; Status: Not recommended; Manufacturer Part Number: 385.0358.1.04.400; ComponentHeight: 8mm; HelpURL: \\cern.ch\dfs\Applications\Altium\Datasheets\COMATEL_385.0358.1.04.400.pdf; Author: CERN DEM JLC; CreateDate: 30.06.2010; LatestRevisionDate: 10.10.2012